# EAGLE design SSOP-20 (EAGLE 6.2)
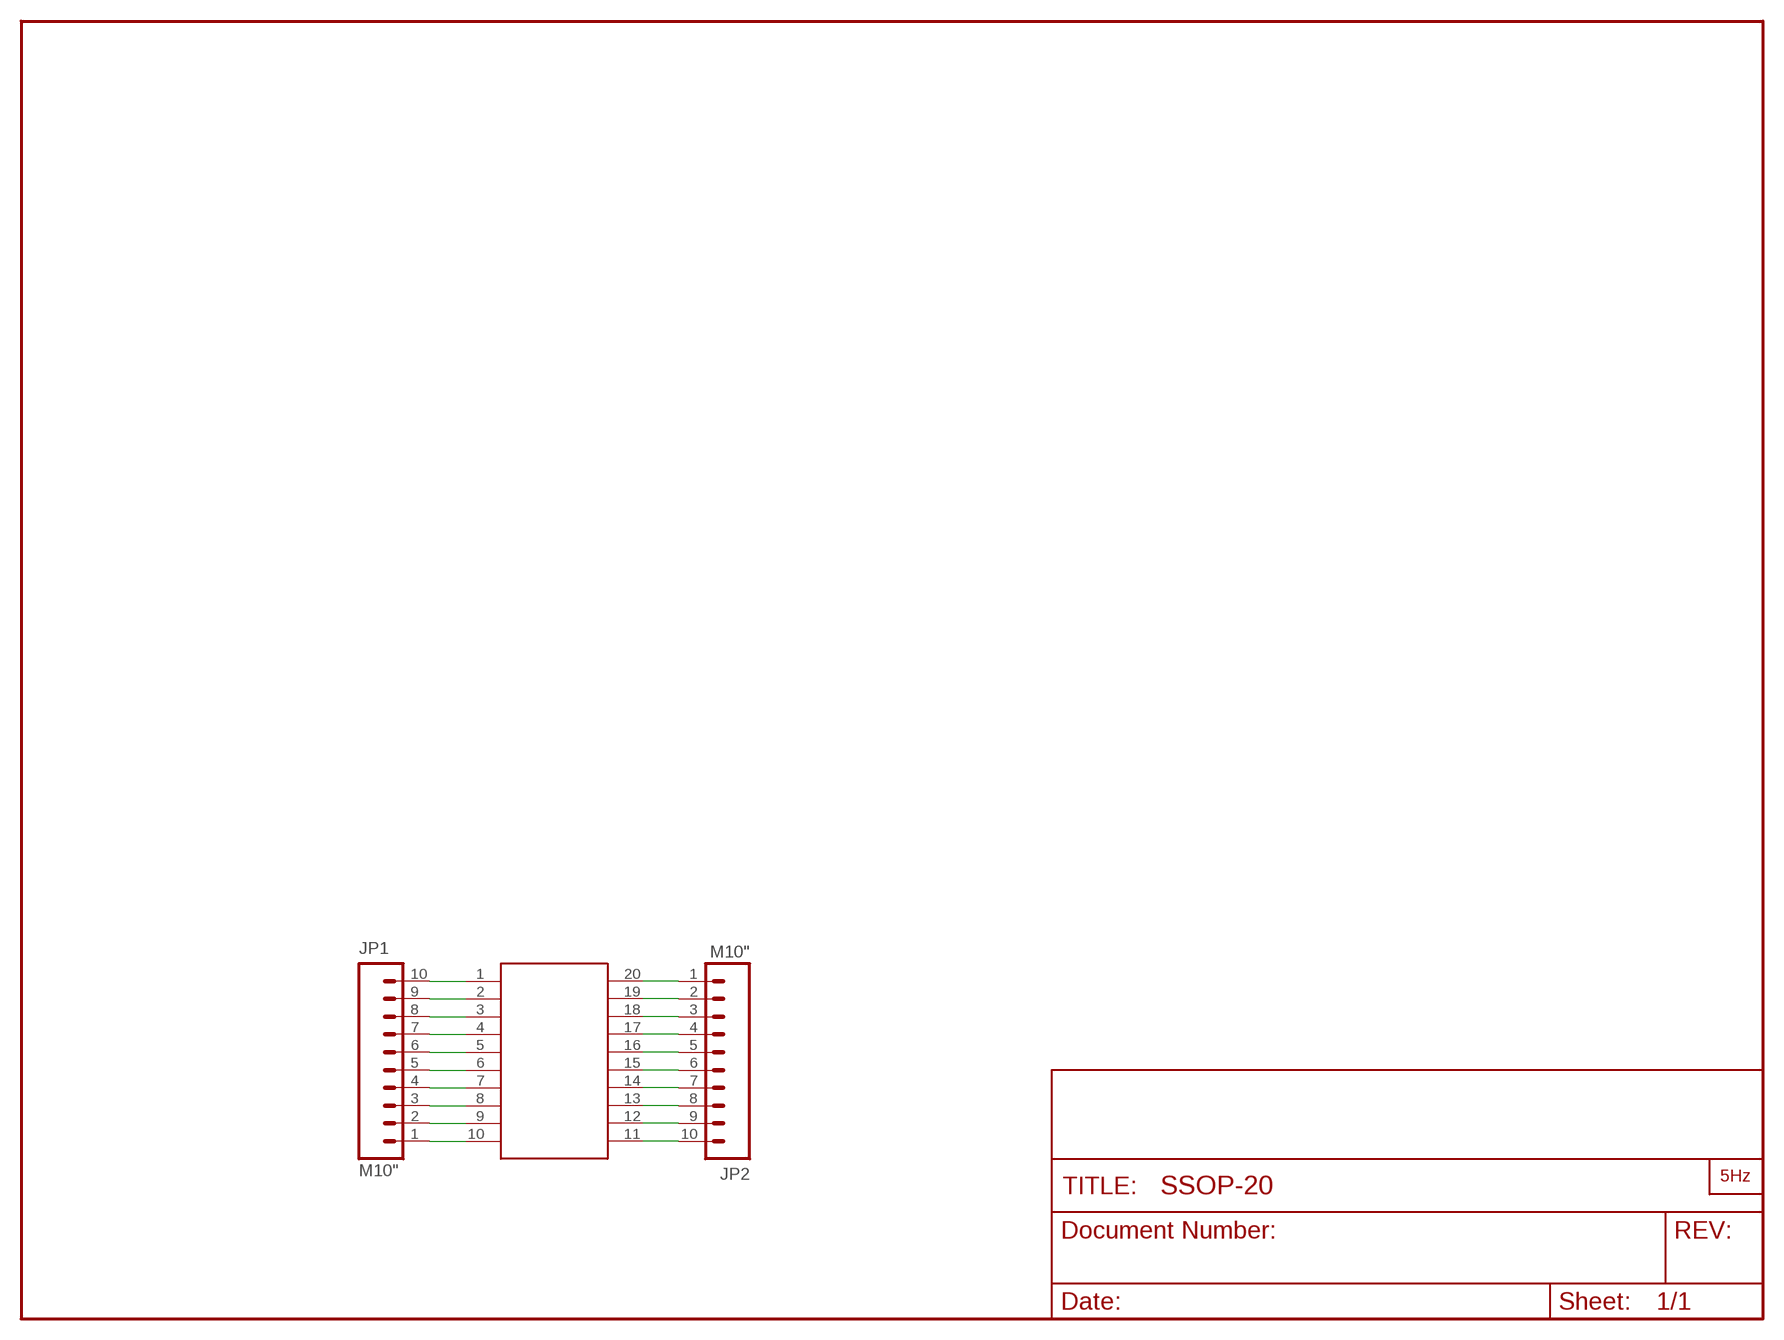
[diagram p0: schematic, sheet 1]

## Parts
JP1  M10"  [1X10]
JP2  M10"  [1X10]
U$1  SSOP-20SSOP-20  [SSOP-20]
U$2  LOGO2_SILK10MM  [LOGO2_10MM]

## Nets
N$1: JP1.1 U$1.10
N$2: JP1.2 U$1.9
N$3: JP1.3 U$1.8
N$4: JP1.4 U$1.7
N$5: JP1.5 U$1.6
N$6: JP1.6 U$1.5
N$7: JP1.7 U$1.4
N$8: JP1.8 U$1.3
N$9: JP1.9 U$1.2
N$10: JP1.10 U$1.1
N$11: JP2.1 U$1.20
N$12: JP2.2 U$1.19
N$13: JP2.3 U$1.18
N$14: JP2.4 U$1.17
N$15: JP2.5 U$1.16
N$16: JP2.6 U$1.15
N$17: JP2.7 U$1.14
N$18: JP2.8 U$1.13
N$19: JP2.9 U$1.12
N$20: JP2.10 U$1.11

## Library data of the parts
JP1 JP2 = SparkFun:M10: Header 10 Standard 10-pin 0.1" header. Use with straight break away headers (SKU : PRT-00116), right angle break away headers (PRT-00553), swiss pins (PRT-00743), machine pins (PRT-00117), and female headers (PRT-00115).
U$1 = MAÑE:SSOP-20
U$2 = LOGO:LOGO2_SILK: PRINCIPAL

## Board
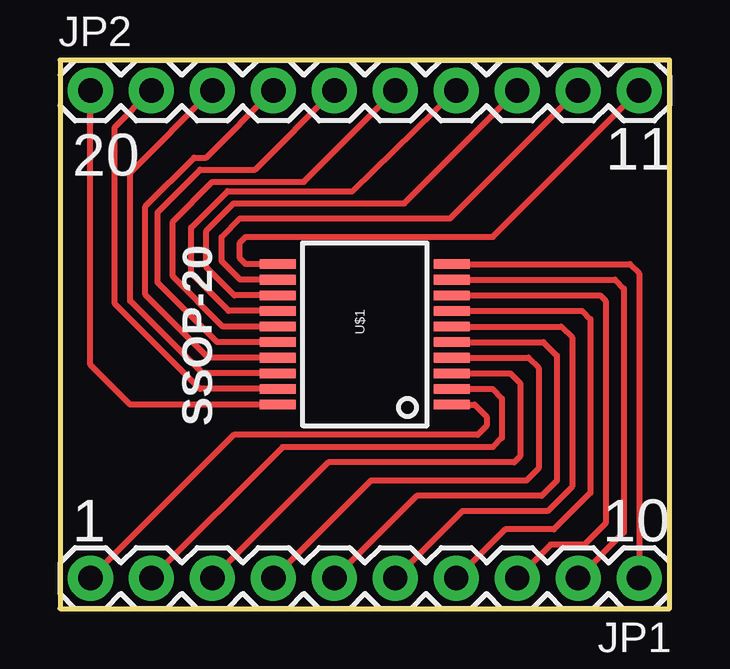
[diagram p1: board, top side]
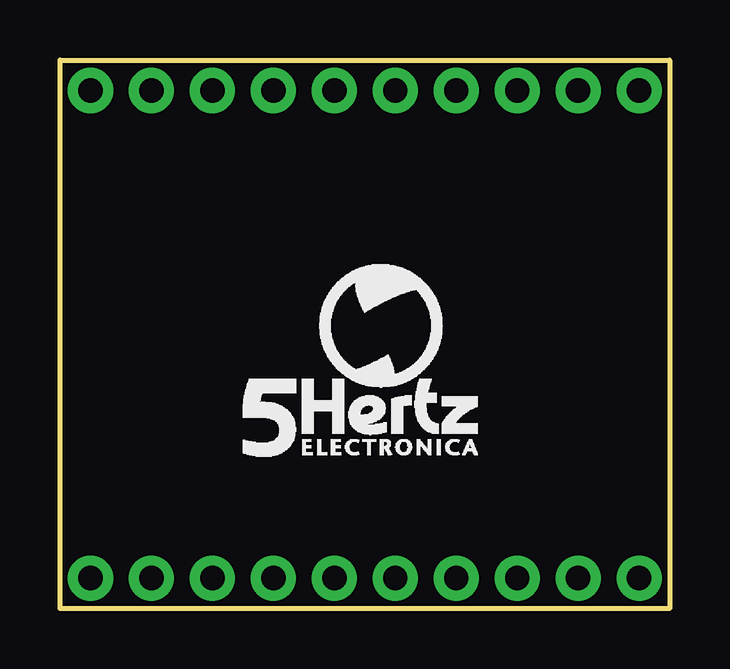
[diagram p2: board, bottom side, seen from below]

Size 25.4 x 22.86 mm. Coordinates in mm from the lower left corner, seen from the top.
Outline: 0,0 25.4,0 25.4,22.86 0,22.86 0,0
Copper layers (1*16): Top 0.035mm / dielectric 1.5mm / Bottom 0.035mm
Design rules: minimum track width 8mil, minimum drill 20mil, track to track 8mil, track to pad 8mil, pad to pad 8mil, via to via 8mil, smd to smd 8mil, copper to edge 10mil, drill to drill 8mil, minimum pad ring 12mil, minimum via ring 10mil, stop-mask expansion 4mil, vias tented up to drill 25mil, thermal gap 10mil

### Footprints (pad centres in the part's own frame; a part is rotated, then mirrored left to right if it is on the bottom)
1X10 = drill 1.016 pad 1.88: 1 0,0; 2 2.54,0; 3 5.08,0; 4 7.62,0; 5 10.16,0; 6 12.7,0; 7 15.24,0; 8 17.78,0; 9 20.32,0; 10 22.86,0
SSOP-20 = smd 0.4 x 1.5: 1 -2.925,-3.625; 2 -2.275,-3.625; 3 -1.625,-3.625; 4 -0.975,-3.625; 5 -0.325,-3.625; 6 0.325,-3.625; 7 0.975,-3.625; 8 1.625,-3.625; 9 2.275,-3.625; 10 2.925,-3.625; 11 2.925,3.625; 12 2.275,3.625; 13 1.625,3.625; 14 0.975,3.625; 15 0.325,3.625; 16 -0.325,3.625; 17 -0.975,3.625; 18 -1.625,3.625; 19 -2.275,3.625; 20 -2.925,3.625

### Placement (x,y rotation side)
JP1  24.13,1.27 180 top
JP2  1.27,21.59 0 top
U$1  12.7,11.43 90 top
U$2  17.78,6.35 0 bottom

### Tracks (layer width: path | path; a pad name or v marks a point on that pad's centre or on a via)
N$1
  Top 0.254: U$1.10 23.75,14.36 24.13,13.97 JP1.1
N$2
  Top 0.254: U$1.9 23.12,13.71 23.5,13.34 23.5,3.17 JP1.2
N$3
  Top 0.254: U$1.8 22.5,13.05 22.73,12.83 22.73,3.56 21.84,2.67 20.45,2.67 JP1.3
N$4
  Top 0.254: U$1.7 21.76,12.4 22.1,12.06 22.1,4.83 20.57,3.3 18.54,3.3 JP1.4
N$5
  Top 0.254: U$1.6 20.88,11.76 21.34,11.3 21.34,5.08 20.32,4.06 16.76,4.06 JP1.5
N$6
  Top 0.254: U$1.5 20.14,11.11 20.7,10.54 20.7,5.33 20.07,4.7 14.86,4.7 JP1.6
N$7
  Top 0.254: U$1.4 19.52,10.46 19.94,10.03 19.94,5.84 19.43,5.33 12.95,5.33 JP1.7
N$8
  Top 0.254: U$1.3 18.77,9.8 19.18,9.4 19.18,6.35 18.92,6.1 11.18,6.1 JP1.8
N$9
  Top 0.254: U$1.2 18.02,9.15 18.41,8.76 18.41,7.11 18.03,6.73 9.27,6.73 JP1.9
N$10
  Top 0.254: U$1.1 17.28,8.51 17.78,8 17.78,7.62 17.4,7.24 7.24,7.24 JP1.10
N$11
  Top 0.254: U$1.20 2.92,8.51 1.27,10.16 JP2.1
N$12
  Top 0.254: U$1.19 5.83,9.15 2.29,12.7 2.29,20.07 JP2.2
N$13
  Top 0.254: U$1.18 5.94,9.8 2.92,12.83 2.92,18.16 JP2.3
N$14
  Top 0.254: U$1.17 6.18,10.46 3.56,13.08 3.56,16.76 5.59,18.8 6.1,18.8 JP2.4
N$15
  Top 0.254: U$1.16 6.55,11.11 4.06,13.59 4.06,16.51 5.84,18.29 8.13,18.29 JP2.5
N$16
  Top 0.254: U$1.15 6.79,11.76 4.7,13.84 4.7,16.13 6.35,17.78 10.16,17.78 JP2.6
N$17
  Top 0.254: U$1.14 7.03,12.4 5.46,13.97 5.46,15.88 6.99,17.4 12.19,17.4 JP2.7
N$18
  Top 0.254: U$1.13 7.26,13.05 6.1,14.22 6.1,15.75 7.24,16.89 14.35,16.89 JP2.8
N$19
  Top 0.254: U$1.12 7.5,13.71 6.73,14.48 6.73,15.49 7.49,16.26 16.26,16.26 JP2.9
N$20
  Top 0.254: U$1.11 7.74,14.36 7.49,14.61 7.49,15.24 7.75,15.49 18.03,15.49 JP2.10

### Text on the board
tPlace: 20 | 11 | SSOP-20 | 1 | 10